# Altium schematic sheet Bluetooth.schdoc
size A4
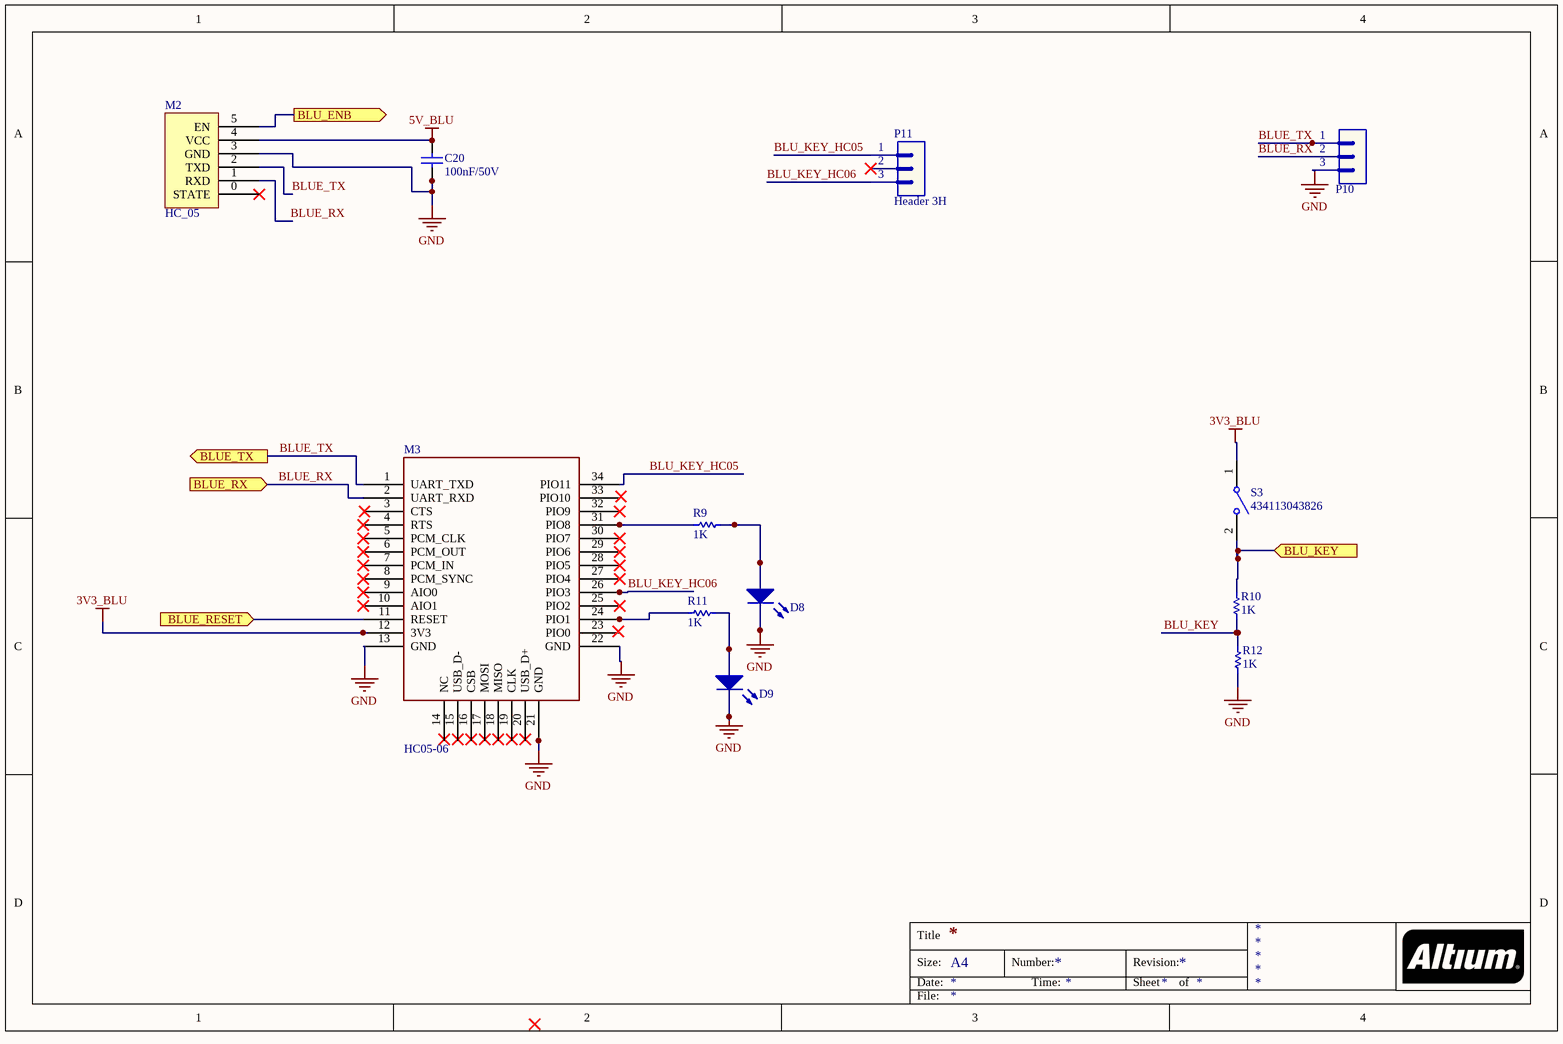
[diagram p0: Bluetooth.schdoc]

## Parts
C20  value 100nF/50V  [CAP-SM-0805]  (hidden comment: Cap-100nF-50V-0805)
D8  LED  [LED_0805_Blue]  (value not drawn)
D9  LED  [LED_0805_Blue]  (value not drawn)
M2  HC_05  [PCBComponent_1]
M3  HC05-06
P10  Header 3  [JP3]  (value not drawn)
P11  Header 3H  [JP3H]
R9  value 1K  [RES-SM-0805]  (hidden comment: Resistor 1/4W)
R10  value 1K  [RES-SM-1206]  (hidden comment: Resistor 1/4W)
R11  value 1K  [RES-SM-0805]  (hidden comment: Resistor 1/4W)
R12  value 1K  [RES-SM-0805]  (hidden comment: Resistor 1/4W)
S3  434113043826  [434113043826]

## Ports
BLU_ENB (out), BLU_KEY (in), BLUE_RESET (in), BLUE_RX (in), BLUE_TX (out)

## Nets
3V3_BLU: M3.12(3V3) S3.1
5V_BLU: C20.2 M2.4(VCC)
GND: C20.1 D8.2(K) D9.2(K) M2.3(GND) M3.13(GND) M3.21(GND) M3.22(GND) P10.3 R12.1
BLU_ENB: M2.5(EN) ; port BLU_ENB
BLU_KEY: R10.1 R12.2
BLU_KEY: R10.2 S3.2 ; port BLU_KEY  [a separate net that carries the same name]
BLU_KEY_HC05: M3.34(PIO11) P11.1
BLU_KEY_HC06: M3.26(PIO3) P11.3
BLUE_RESET: M3.11(RESET) ; port BLUE_RESET
BLUE_RX: M2.1(RXD) M3.2(UART_RXD) P10.2 ; port BLUE_RX
BLUE_TX: M2.2(TXD) M3.1(UART_TXD) P10.1 ; port BLUE_TX
NetD8_1: D8.1(A) R9.1
NetD9_1: D9.1(A) R11.1
NetM3_24: M3.24(PIO1) R11.2
NetM3_31: M3.31(PIO8) R9.2

Not connected (* = marked no-connect by the designer): M2 0(STATE)*; M3 3(CTS) 4(RTS)* 5(PCM_CLK)* 6(PCM_OUT)* 7(PCM_IN)* 8(PCM_SYNC)* 9(AIO0)* 10(AIO1)* 14(NC) 15(USB_D-) 16(CSB) 17(MOSI) 18(MISO) 19(CLK) 20(USB_D+) 23(PIO0) 25(PIO2)* 27(PIO4)* 28(PIO5)* 29(PIO6)* 30(PIO7)* 32(PIO9)* 33(PIO10); P11 2*

## Notes on the sheet
- Title
- Size:
- Date:
- A4
- Number:
- Time:
- Revision:
- Sheet
- of
- File:

## Library data of the parts
C20 = Cap-100nF-50V-0805: CAP CER 0.1UF 50V Y5V 0805; Manufacturer: Samsung Electro-Mechanics; Manufacturer Part Number: CL21F104ZBCNNNC; Local Supplier: thegioiic; Local Supplier Link: https://thegioiic.com/products/tu-100nf-0-1uf-50v-0805; Supplier 1: Digikey; Supplier 1 Part Number: 1276-1007-1-ND; Supplier 1 Link: https://www.digikey.com/product-detail/en/samsung-electro-mechanics/CL21F104ZBCNNNC/1276-1007-1-ND/3889093
P10 = Header 3: Header, 3-Pin; LatestRevisionDate: 17-Jul-2002; LatestRevisionNote: Re-released for DXP Platform.; Publisher: Altium Limited
P11 = Header 3H: Header, 3-Pin, Right Angle; LatestRevisionDate: 17-Jul-2002; LatestRevisionNote: Re-released for DXP Platform.; Publisher: Altium Limited
R9-R12 = RES
S3 = 434113043826: WS-TASV J-Bend SMT Tact Switch 6x3.5mm, height 4.3mm, 260gf; Rated Voltage: 12VDC; Rated Current: 50mA; Washable: No; ComponentLink1Description: Manufacturer; ComponentLink1URL: http://www.we-online.de; ComponentLink2Description: Datasheet; ComponentLink2URL: https://katalog.we-online.com/em/datasheet/434113043826.pdf; Operating Temperature: -40 to +85degC; Part Number: 434113043826; Published Date: September 2019; Contact Material: Stainless Steel; Height: 4.3mm; Mounting Technology: SMT; Contact Plating: Silver; Operation Force: 260gf; Packaging: Tape and Reel; Terminal Material: Copper Alloy; Publisher: Wurth Elektronik; Terminal Plating: Silver